# Altium schematic sheet ESP32.SchDoc
size A4; SheetNumber: 1; SheetTotal: 6
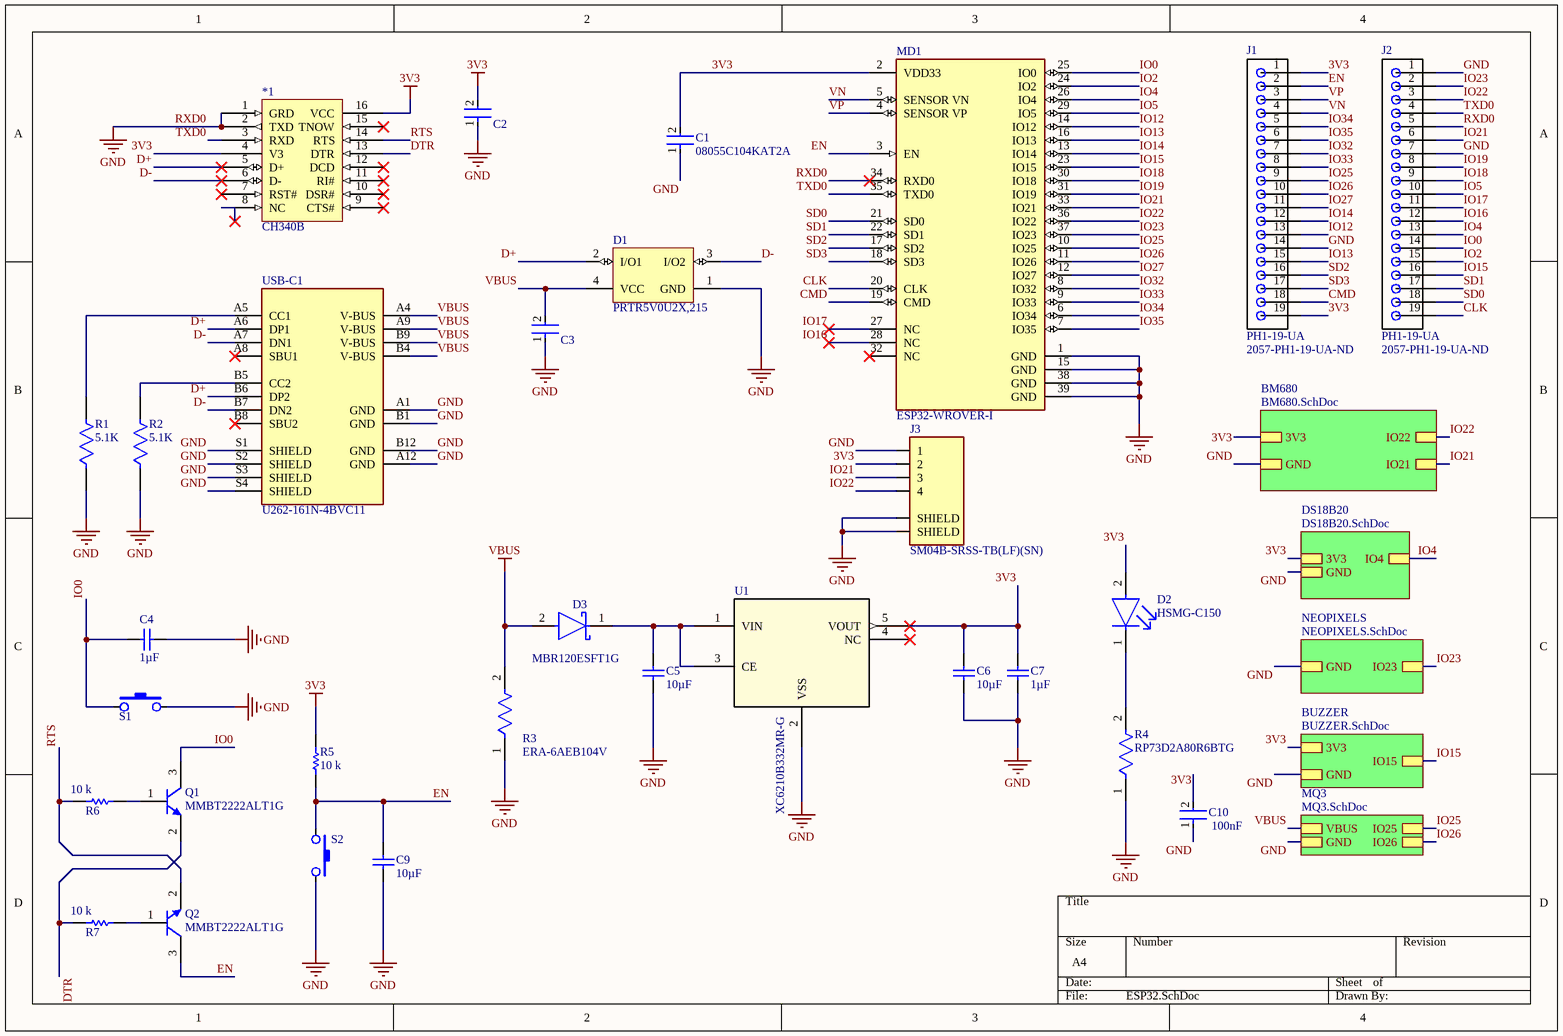
[diagram p0: ESP32.SchDoc]

## Parts
*1  CH340B  [CH340B]
C1  08055C104KAT2A  [FP-0805-L_2_01_0_2-W_1_25-IPC_C]
C2  08055C104KAT2A  [FP-0805-L_2_01_0_2-W_1_25-IPC_C]  (value not drawn)
C3  08055C104KAT2A  [FP-0805-L_2_01_0_2-W_1_25-IPC_C]  (value not drawn)
C4  1µF  [CAPC2013X145X50LL20T25]
C5  10µF  [CAPC2013X140X50LL20T25]
C6  10µF  [CAPC2013X140X50LL20T25]
C7  1µF  [CAPC2013X145X50LL20T25]
C9  10µF  [CAPC2013X145X50LL20T25]
C10  100nF  [FP-0805-L_2_01_0_2-W_1_25-IPC_C]
D1  PRTR5V0U2X,215  [NXP-SOT143B-4_V]
D2  HSMG-C150  [FP-HSMG-C150-MFG]
D3  MBR120ESFT1G  [On_Semiconductor_498_MFG]
J1  PH1-19-UA  Supplier Part Number 1: 2057-PH1-19-UA-ND  [PH1-19-UA]
J2  PH1-19-UA  Supplier Part Number 1: 2057-PH1-19-UA-ND  [PH1-19-UA]
J3  SM04B-SRSS-TB(LF)(SN)  [JST_SM04B-SRSS-TB(LF)(SN)]
MD1  ESP32-WROVER-I  [FP-ESP32-WROVER-I-MFG]
Q1  MMBT2222ALT1G  [ONSC-SOT-23-3-318-08_V]
Q2  MMBT2222ALT1G  [ONSC-SOT-23-3-318-08_V]
R1  5.1K  [FP-CRCW0805-e3-IPC_A]
R2  5.1K  [FP-CRCW0805-e3-MFG]
R3  ERA-6AEB104V  [FP-ERA6A-IPC_B]
R4  RP73D2A80R6BTG  [FP-RP732A-IPC_A]
R5  10 k  [RESC2013X60X30LL20T20]
R6  10 k  [RESC2013X60X30LL20T20]
R7  10 k  [RESC2013X60X30LL20T20]
S1  IO0  [SMT_SW_PTS_820]  (value not drawn)
S2  PTS820J25MSMTRLFS  [SMT_SW_PTS_820]  (value not drawn)
U1  XC6210B332MR-G  [SOT-25_TOR-M]
USB-C1  U262-161N-4BVC11  [U262-161N-4BVC11]

## Sub-sheets
BM680 = BM680.SchDoc: IO22, IO21, GND, 3V3
BUZZER = BUZZER.SchDoc: 3V3, IO15, GND
DS18B20 = DS18B20.SchDoc: 3V3, GND, IO4
MQ3 = MQ3.SchDoc: IO25, IO26, VBUS, GND
NEOPIXELS = NEOPIXELS.SchDoc: GND, IO23

## Nets
3V3: *1.4(V3) *1.16(VCC) C1.2 C2.2 C6.2 C7.2 C10.2 D2.2(A) J1.1 J1.19 J3.2 MD1.2(VDD33) R5.2 U1.5(VOUT) ; sheet DS18B20/3V3, sheet BM680/3V3, sheet BUZZER/3V3
GND: *1.1(GRD) *1.2(TXD) C1.1 C2.1 C3.1 C4.1 C5.1 C6.1 C7.1 C9.1 C10.1 D1.1(GND) J1.14 J2.1 J2.5 J2.7 J3.1 J3.S1(SHIELD) J3.S2(SHIELD) MD1.1(GND) MD1.15(GND) MD1.34(RXD0) MD1.38(GND) MD1.39(GND) R1.1 R2.1 R3.1 R4.1 S1.2 S2.2 U1.2(VSS) USB-C1.A1(GND) USB-C1.A12(GND) USB-C1.B1(GND) USB-C1.B12(GND) USB-C1.S1(SHIELD) USB-C1.S2(SHIELD) USB-C1.S3(SHIELD) USB-C1.S4(SHIELD) ; sheet DS18B20/GND, sheet BM680/GND, sheet NEOPIXELS/GND, sheet BUZZER/GND, sheet MQ3/GND  [also labelled RXD0]
VBUS: C3.2 D1.4(VCC) D3.2(A) R3.2 USB-C1.A4(V-BUS) USB-C1.A9(V-BUS) USB-C1.B4(V-BUS) USB-C1.B9(V-BUS) ; sheet MQ3/VBUS
CLK: J2.19 MD1.20(CLK)
CMD: J1.18 MD1.19(CMD)
D+: *1.5(D+) D1.2(I/O1) USB-C1.A6(DP1) USB-C1.B6(DP2)
D-: *1.6(D-) D1.3(I/O2) USB-C1.A7(DN1) USB-C1.B7(DN2)
DTR: *1.13(DTR) Q1.2(E) R7.2
EN: C9.2 J1.2 MD1.3(EN) Q2.3(C) R5.1 S2.1
IO0: C4.2 J2.14 MD1.25(IO0) Q1.3(C) S1.1
IO2: J2.15 MD1.24(IO2)
IO4: J2.13 MD1.26(IO4) ; sheet DS18B20/IO4
IO5: J2.10 MD1.29(IO5)
IO12: J1.13 MD1.14(IO12)
IO13: J1.15 MD1.16(IO13)
IO14: J1.12 MD1.13(IO14)
IO15: J2.16 MD1.23(IO15) ; sheet BUZZER/IO15
IO16: J2.12 MD1.28(NC)
IO17: J2.11 MD1.27(NC)
IO18: J2.9 MD1.30(IO18)
IO19: J2.8 MD1.31(IO19)
IO21: J2.6 J3.3 MD1.33(IO21) ; sheet BM680/IO21
IO22: J2.3 J3.4 MD1.36(IO22) ; sheet BM680/IO22
IO23: J2.2 MD1.37(IO23) ; sheet NEOPIXELS/IO23
IO25: J1.9 MD1.10(IO25) ; sheet MQ3/IO25
IO26: J1.10 MD1.11(IO26) ; sheet MQ3/IO26
IO27: J1.11 MD1.12(IO27)
IO32: J1.7 MD1.8(IO32)
IO33: J1.8 MD1.9(IO33)
IO34: J1.5 MD1.6(IO34)
IO35: J1.6 MD1.7(IO35)
RTS: *1.14(RTS) Q2.2(E) R6.2
SD0: J2.18 MD1.21(SD0)
SD1: J2.17 MD1.22(SD1)
SD2: J1.16 MD1.17(SD2)
SD3: J1.17 MD1.18(SD3)
TXD0: *1.3(RXD) J2.4 MD1.35(TXD0)
VN: J1.4 MD1.5(SENSOR_VN)
VP: J1.3 MD1.4(SENSOR_VP)
NetC5_2: C5.2 D3.1(C) U1.1(VIN) U1.3(CE)
NetD2_1: D2.1(C) R4.2
NetQ1_1: Q1.1(B) R6.1
NetQ2_1: Q2.1(B) R7.1
NetR1_2: R1.2 USB-C1.A5(CC1)
NetR2_2: R2.2 USB-C1.B5(CC2)

Not connected (* = marked no-connect by the designer): *1 7(RST#)* 8(NC)* 9(CTS#)* 10(DSR#)* 11(RI#)* 12(DCD)* 15(TNOW)*; MD1 32(NC)*; U1 4(NC)*; USB-C1 A8(SBU1)* B8(SBU2)*

## Library data of the parts
*1 = CH340B: - USB 2.0 Transceiver 2Mbps SOP-16_150mil USB ICs ROHS; ComponentLink1Description: Datasheet; ComponentLink1URL: https://www.mpja.com/download/35227cpdata.pdf
C1-C3 C10 = CMP-2000-05016-2: General Purpose Ceramic Capacitor, 0805, 100nF, 10%, X7R, 0.15, 50V; Dissipation Factor: 2.5%; Insulation Resistance: 100GR; Capacitance: 100nF; Dielectric: X7R; Voltage Rating (DC): 50V; Package Quantity: 4000; Tolerance: 10%; Voltage Rating: 50V; Case/Package: 0805; Lead Free: Lead Free; Dielectric Material: Ceramic; Thickness: 0.037inch; Weight: 0.001411oz; Max Operating Temperature: 125°C; REACH SVHC: No SVHC; Mount: Surface Mount; RoHS Compliant: Yes; Depth: 1.25mm; Height: 0.5mm; Case Code (Metric): 2012; Length: 2mm; Termination: Standard; Case Code (Imperial): 0805; Number of Pins: 2; Voltage: 50V; Radiation Hardening: No; Min Operating Temperature: -55°C; Width: 1.2mm; Series: MLCC X7R; Packaging: Cut Tape
C4 C7 C9 = CMP-2007-01082-1: 1µF ±10% 16V Ceramic Capacitor X7R 0805 (2012 Metric); Manufacturer: Kemet; Part Number: C0805C105K4RAC7800
C5 C6 = CMP-2007-03242-1: 10µF ±10% 16V Ceramic Capacitor X5R 0805 (2012 Metric); Part Number: CL21A106KOQNNNG
D1 = CMP-2000-05285-1: Ultra Low Capacitance Double Rail-to-Rail ESD Protection Diode, 5.5 V, 1 pF, -40 to 85 degC, 4-Pin SOT143B, RoHS, Tape and Reel; Manufacturer: NXP Semiconductors; Capacitance Value: 16pF; Number of Elements: 1; Rad Hardened: No; Reverse Breakdown Voltage: 6V; Working Voltage (Max): 5.5V; Polarity: Uni-Directional; Configuration: Quad; Leakage Current: 0.1uA; Product Height (mm): 1mm; Suppressor Type: DiodeArrays; Product Length (mm): 3mm; Product Depth (mm): 1.4mm; ESD Protection Voltage: 8KV@ContactDisc; Package Type: SOT; Mounting: SurfaceMount; Packaging: TapeandReel; Datasheet Version: Rev. 02, 01/2008; Reverse Stand-off Voltage: 5.5V; Manufacturer URL: http://www.nxp.com/; Operating Temp Range: -40Cto85C; Operating Temperature Classification: Industrial; Working Voltage: 5.5V; Operating Temperature Min Deg. C: -40C; Datasheet URL: https://datasheet.ciiva.com/4479/prtr5v0u2x-102853-4479461.pdf; Leakage Current (Max): 0.1uA; Direction Type: Uni-Directional; Pin Count: 3+Tab; Operating Temperature Max Deg. C: 85C; Mounting Style: SurfaceMount; Package / Case: SOT
D2 = CMP-2000-05061-2: LED GREEN DIFFUSED 1206 SMD; Manufacturer: Broadcom; Led Orientation: Top View; Max Junction Temp: +95°C; Peak Emmision Wavelength: 570nm; Viewing Angle: 170°; Wavelength: 572nm; Reverse Voltage: 5V; Luminous Intensity: 15mcd; Forward Voltage: 2.2V; Power Dissipation: 65mW; Forward Current: 20mA; ComponentLink2Description: Datasheet; Lead Free: Yes; Temperature Range Low: -40°C; Package: HSMG-C150; Digikey Description: LED GREEN DIFFUSED 1206 SMD; Mouser Description: LED Uni-Color Green 570nm 2-Pin Chip LED T/R; Manufacturer Part Number: HSMG-C150; Temperature Range High: +85°C; Device Class L1: Optoelectronics; Colour: Green; Category: Diode; Device Class L3: unset; RoHS: TRUE; Height: 1.2mm; ComponentLink2URL: https://docs.broadcom.com/docs/AV02-0551EN; Device Class L2: LEDs; Automotive: No; Ipc Land Pattern Name: DIOCP320160X55; Octopart: https://octopart.com/hsmg-c150-broadcom-71131304; Temperature: -40°C to +85°C
D3 = CMP-1055-00434-2: NexarPartId: 330787; Manufacturer Lifecycle Status: ACTIVE; Voltage Rating (DC): 20V; Max Forward Surge Current (Ifsm): 40A; Output Current: 1A; Max Junction Temperature (Tj): 150°C; Polarity: Standard; Peak Reverse Current: 10µA; Element Configuration: Single; Forward Voltage: 530mV; RoHS: Compliant; Lifecycle Status: Production; Packaging: Cut Tape; Lead Free: Lead Free; Radiation Hardening: No; Min Operating Temperature: -65°C; Average Rectified Current: 1A; Current Rating: 1A; Max Reverse Voltage (DC): 20V; REACH SVHC: No SVHC; Max Surge Current: 40A; Length: 2.9mm; Forward Current: 1A; Height: 880µm; Contact Plating: Tin; Width: 1.8mm; Reverse Voltage: 20V; Schedule B: 8541100080; Peak Non-Repetitive Surge Current: 40A; Max Operating Temperature: 150°C; Max Repetitive Reverse Voltage (Vrrm): 20V; Max Reverse Leakage Current: 10µA; Number of Pins: 2; Halogen Free: Halogen Free
J1 J2 = PH1-19-UA: Connector Header Through Hole 19 position 0.100" (2.54mm); Supplier 1: Digi-Key
J3 = SM04B-SRSS-TB(LF)(SN): Connector Header Surface Mount, Right Angle 4 position 0.039 _1.00mm_; MF: JST Sales; MP: SM04B-SRSS-TB_LF__SN_; Price: None; SnapEDA_Link: https://www.snapeda.com/parts/SM04B-SRSS-TB%28LF%29%28SN%29/JST%20Sales%20America%20Inc./view-part/557466/?ref=snap; Value: *; Availability: Unavailable; Package: None
MD1 = CMP-194065-000001-1: SMD MODULE, ESP32-D0WDQ6, 32MBIT; Manufacturer: Espressif; Number Of Adc Channels: 16; Min Supply Voltage: 2.3V; Interface: I2C,SPI,UART,I2S,Other; Max Frequency: 2484MHz; Nominal Supply Current: 500mA; Sensitivity: -98dBm; Max Supply Voltage: 3.6V; Number Of Gpio: 20; Data Rate: 150Mbits/s; Package: ESP32-WROVER-I; Temperature Range Low: -40°C; Temperature Range High: +85°C; Device Class L1: Integrated Circuits (ICs); Category: UNK; ComponentLink2Description: Datasheet; Device Class L2: RF Semiconductors and Devices; Automotive: No; Lead Free: Yes; Octopart: https://octopart.com/esp32-wrover-i-espressif+systems-89171349; ComponentLink2URL: https://www.espressif.com/sites/default/files/documentation/esp32-wrover_datasheet_en.pdf; Temperature: -40°C to +85°C; Height: 3.4mm; RoHS: TRUE; Digikey Description: SMD MODULE, ESP32-D0WDQ6, 32MBIT; Device Class L3: Transceivers; Manufacturer Part Number: ESP32-WROVER-I
Q1 Q2 = CMP-1048-00538-1: General Purpose Transistor, NPN Silicon, 3-Pin SOT-23, Pb-Free, Tape and Reel; Manufacturer: On Semiconductor; fT Min (MHz): 300; IC Continuous (A): 0.6; ComponentLink3URL: http://www.onsemi.cn/pub_link/Collateral/318-08.PDF; PartNumber: MMBT2222ALT1G; RoHS: TRUE; ComponentLink1URL: http://www.onsemi.com/; ComponentLink3Description: Package Specification; ComponentLink2Description: Datasheet; Mounting Technology: Surface Mount; Packing: Tape and Reel; PackageDescription: 3-Pin Small Outline Transistor, Body 2.92 x 1.3 mm, Pitch 0.95 mm; DatasheetVersion: Rev. 10; PackageReference: SOT-23-3-318-08; ComponentLink2URL: http://www.onsemi.cn/pub_link/Collateral/MMBT2222LT1-D.PDF; Polarity: NPN; PackageVersion: Rev. AP, 11/2009; ComponentLink1Description: Manufacturer URL
R1 R2 = CMP-2001-04024-2: RES Thick Film, 5.1kΩ, 1%, 0.125W, 100ppm/°C, 0805; Power Rating: 125mW; Voltage Rating (DC): 150V; Resistance: 5.1kR; Packaging: Tape and Reel; Case Code (Metric): 2012; Contact Plating: Tin; Case Code (Imperial): 0805; Depth: 1.25mm; Tolerance: 1%; Width: 0.049inch; Temperature Coefficient: 100ppm/°C; Max Power Dissipation: 125mW; Military Standard: Not; Lead Free: Lead Free; Mount: Surface Mount; Min Operating Temperature: -55°C; Package Quantity: 10; Weight: 0.000194oz; Height: 0.45mm; Number of Terminations: 2; Max Operating Temperature: 155°C; Termination: SMD/SMT; Case/Package: 0805; Composition: Thick Film; Voltage Rating: 150V; Length: 2mm; Features: Automotive AEC-Q200; Radiation Hardening: No
R3 = CMP-2001-00583-2: RES 100K OHM 0.1% 1/8W 0805; Max Power Dissipation: 125mW; Voltage Rating: 100V; Resistance: 100kR; Temperature Coefficient: 25ppm/°C; Resistance Tolerance: 0.1%; Resistor Type: Thin Film; Mount: Surface Mount; Package Quantity: 1; RoHS Compliant: Yes; Features: Automotive AEC-Q200; Termination: Solder; Contact Plating: Tin; Number of Pins: 2; Construction: Rectangular; Size Code: 0805; Case/Package: 0805; Military Standard: Not; Voltage Rating (DC): 100V; Max Operating Temperature: 155°C; REACH SVHC: No SVHC; Series: ERA-6A; Case Code (Metric): 2012; Number of Terminations: 2; Tolerance: 0.1%; Width: 1.25mm; Depth: 1.25mm; Lead Free: Lead Free; Radiation Hardening: No; Length: 2mm; Technology: METAL FILM; Power Rating: 125mW; Min Operating Temperature: -55°C; Height: 0.5mm; Case Code (Imperial): 0805; Packaging: Tape and Reel
R4 = CMP-03211-002377-1: RESISTOR, 0805 80.6Ω, 0.1% 15ppm/°C; Manufacturer: TE Connectivity; Power Rating: 0.125W; Voltage Rating: 150V; ComponentLink2URL: https://www.te.com/commerce/DocumentDelivery/DDEController?Action=srchrtrv&DocNm=1773272&DocType=DS&DocLang=English; Device Class L3: Chip SMD Resistors; Automotive: No; ComponentLink2Description: Datasheet; Series: RP73; Temperature Coefficient: 15ppm/°C; Octopart: https://octopart.com/rp73d2a80r6btg-te+connectivity-42011633; octopart_url: https://octopart.com/rp73d2a80r6btg-te+connectivity-42011633; Device Class L2: Resistors; Device Class L1: Passive Components; Value: 80.6Ω; Composition: Thin Film; Lead Free: Yes; Ipc Land Pattern Name: RESC200125X55; Resistance: 80.6Ω; Package: RP732A; packaging: 250 cut tape length; Height: 0.65mm; Tolerance: 0.1%; Manufacturer Part Number: RP73D2A80R6BTG; Temperature: -55°C to 155°C; Temperature Range High: 155°C; RoHS: TRUE; Category: Res; Temperature Range Low: -55°C
R5-R7 = CMP-2001-04657-1: 10 kOhms ±5% 0.25W, 1/4W Chip Resistor 0805 (2012 Metric) Automotive AEC-Q200, Moisture Resistant Thick Film; Part Number: RK73B2ATTD103J; Manufacturer: KOA Speer
S1 = PTS820J25MSMTRLFS
U1 = XC6210B332MR-G: No Description Available; Mfr_Name: Torex Semiconductor; Copyright: Copyright (C) 2022 Ultra Librarian. All rights reserved.; Manufacturer_Part_Number: XC6210B332MR-G; RefDes: RefDes; Type: DEV
USB-C1 = U262-161N-4BVC11: USB - Type C Female 16 SMT USB Connectors RoHS; ComponentLink1Description: datasheet; ComponentLink1URL: https://datasheet.lcsc.com/szlcsc/2002271811_XKB-Connectivity-U262-161N-4BVC11_C319148.pdf; ComponentLink2Description: LCSC Link; ComponentLink2URL: https://lcsc.com/product-detail/USB-Connectors_XKB-Connectivity-U262-161N-4BVC11_C319148.html